# Altium project CtrlBoard_V3.PrjPcb
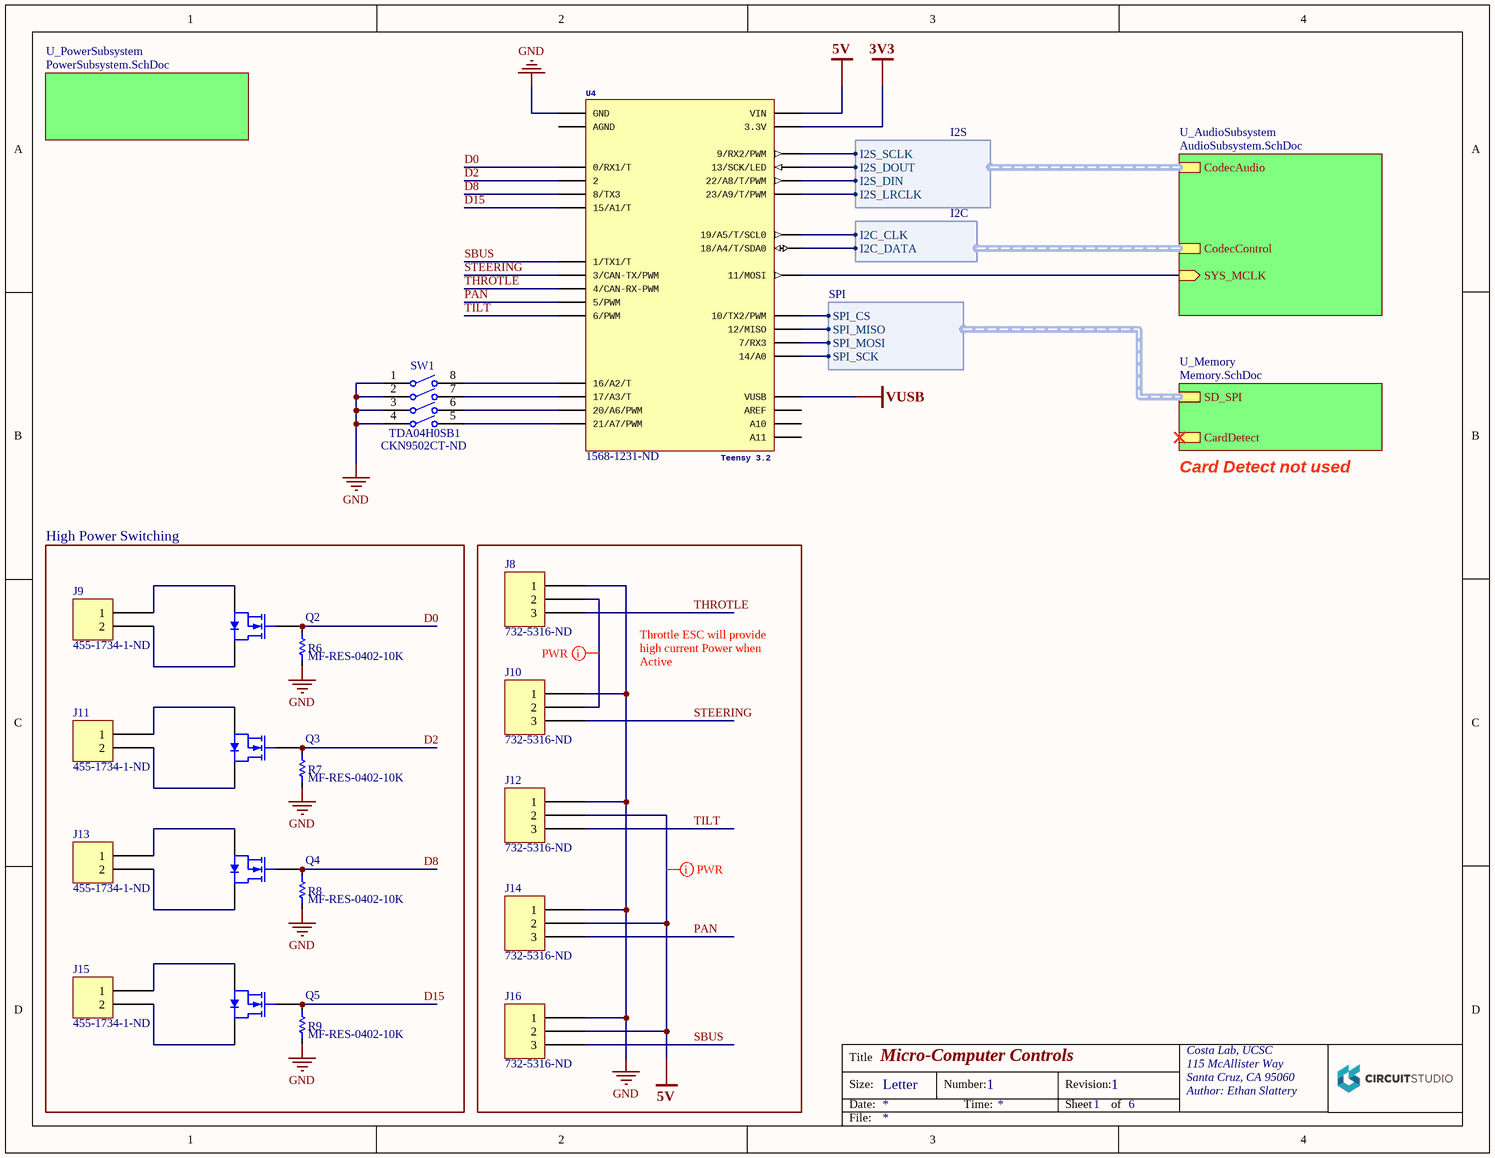
[diagram p0: Teensy32.SchDoc]
Organization: Costa Lab, UCSC; Author: Ethan Slattery; Address3: Author: Ethan Slattery; Address2: Santa Cruz, CA 95060; Address1: 115 McAllister Way
6 sheets, 57 parts. Net scope: hierarchical (ports join the sheet entries above them; power ports are global).
Sheets:
  Teensy32.SchDoc
    U_AudioSubsystem = AudioSubsystem.SchDoc
      U_AudioAmp = AudioAmp.SchDoc
      U_AudioCodec = AudioCodec.SchDoc
    U_Memory = Memory.SchDoc
    U_PowerSubsystem = PowerSubsystem.SchDoc

## Sheet Teensy32.SchDoc: Micro-Computer Controls
size Letter; Organization: Costa Lab, UCSC; Address1: 115 McAllister Way; Address2: Santa Cruz, CA 95060; Address3: Author: Ethan Slattery; DocumentNumber: 1; Revision: 1; SheetNumber: 1; SheetTotal: 6

### Parts
(Parts that share a designator on the sheet are numbered #1, #2 ... from top to bottom, then left to right.)
J8  Supplier Part Number 1: 732-5316-ND  [Pinhead_1x3]  (hidden comment: Header)
J9  455-1734-1-ND  [JST B2B-PH-SM4]
J10  Supplier Part Number 1: 732-5316-ND  [Pinhead_1x3]  (hidden comment: Header)
J11  455-1734-1-ND  [JST B2B-PH-SM4]
J12  Supplier Part Number 1: 732-5316-ND  [Pinhead_1x3]  (hidden comment: Header)
J13  455-1734-1-ND  [JST B2B-PH-SM4]
J14  Supplier Part Number 1: 732-5316-ND  [Pinhead_1x3]  (hidden comment: Header)
J15  455-1734-1-ND  [JST B2B-PH-SM4]
J16  Supplier Part Number 1: 732-5316-ND  [Pinhead_1x3]  (hidden comment: Header)
Q2  MOSFET N-Ch  [TO-220]  (value not drawn)
Q3  MOSFET N-Ch  [TO-220]  (value not drawn)
Q4  MOSFET N-Ch  [TO-220]  (value not drawn)
Q5  MOSFET N-Ch  [TO-220]  (value not drawn)
R6#1  MF-RES-0402-10K  [R0402L]
R7  MF-RES-0402-10K  [R0402L]
R8  MF-RES-0402-10K  [R0402L]
R9  MF-RES-0402-10K  [R0402L]
SW1  TDA04H0SB1  Supplier Part Number 1: CKN9502CT-ND  [CKCP-TDA04H0SB1R_V]
U4  Teensy 3.2  Supplier Part Number 1: 1568-1231-ND  [TEENSY_3.0-3.2&LC_SMD+4]

### Blocks framed on the sheet
High Power Switching: J9 J11 J13 J15 Q2-Q5 R6#1 R7-R9

### Sub-sheets
U_AudioSubsystem = AudioSubsystem.SchDoc: SYS_MCLK (in), CodecControl (harness I2C), CodecAudio (harness I2S)
U_Memory = Memory.SchDoc: SD_SPI (harness SPI), CardDetect
U_PowerSubsystem = PowerSubsystem.SchDoc: no entries

### Harnesses
I2S: I2S_DIN, I2S_DOUT, I2S_LRCLK, I2S_SCLK
I2C: I2C_CLK, I2C_DATA
SPI: SPI_CS, SPI_MISO, SPI_MOSI, SPI_SCK

### Nets
3V3: U4.3.3V
5V: J12.2 J14.2 J16.2 U4.VIN
GND: J8.1 J10.1 J12.1 J14.1 J16.1 R6#1.2 R7.2 R8.2 R9.2 SW1.1 SW1.2 SW1.3 SW1.4 U4.GND
VUSB: U4.VUSB
D0: Q2.1(G) R6#1.1 U4.0(0/RX1/T)  [project net D0_1]
D2: Q3.1(G) R7.1 U4.2  [project net D2_1]
D8: Q4.1(G) R8.1 U4.8(8/TX3)  [project net D8_1]
D15: Q5.1(G) R9.1 U4.15/A1(15/A1/T)  [project net D15_1]
PAN: J14.3 U4.5(5/PWM)  [project net PAN_1]
SBUS: J16.3 U4.1(1/TX1/T)  [project net SBUS_1]
STEERING: J10.3 U4.3(3/CAN-TX/PWM)  [project net STEERING_1]
SYS_MCLK: U4.11(11/MOSI) ; sheet U_AudioSubsystem/SYS_MCLK
THROTLE: J8.3 U4.4(4/CAN-RX-PWM)  [project net THROTLE_1]
TILT: J12.3 U4.6(6/PWM)  [project net TILT_1]
NetJ8_2: J8.2 J10.2
NetJ9_1: J9.1 Q2.3(S)
NetJ9_2: J9.2 Q2.2(D)
NetJ11_1: J11.1 Q3.3(S)
NetJ11_2: J11.2 Q3.2(D)
NetJ13_1: J13.1 Q4.3(S)
NetJ13_2: J13.2 Q4.2(D)
NetJ15_1: J15.1 Q5.3(S)
NetJ15_2: J15.2 Q5.2(D)
NetSW1_5: SW1.5 U4.21/A7(21/A7/PWM)
NetSW1_6: SW1.6 U4.20/A6(20/A6/PWM)
NetSW1_7: SW1.7 U4.17/A3(17/A3/T)
NetSW1_8: SW1.8 U4.16/A2(16/A2/T)
NetU2_14: U4.23/A9(23/A9/T/PWM) ; sheet U_AudioSubsystem/CodecAudio.I2S_LRCLK
NetU2_15: U4.9(9/RX2/PWM) ; sheet U_AudioSubsystem/CodecAudio.I2S_SCLK
NetU2_16: U4.13(13/SCK/LED) ; sheet U_AudioSubsystem/CodecAudio.I2S_DOUT
NetU2_17: U4.22/A8(22/A8/T/PWM) ; sheet U_AudioSubsystem/CodecAudio.I2S_DIN
NetU2_18: U4.18/A4(18/A4/T/SDA0) ; sheet U_AudioSubsystem/CodecControl.I2C_DATA
NetU2_19: U4.19/A5(19/A5/T/SCL0) ; sheet U_AudioSubsystem/CodecControl.I2C_CLK
NetU4_7: U4.7(7/RX3) ; sheet U_Memory/SD_SPI.SPI_MOSI
NetU4_10: U4.10(10/TX2/PWM) ; sheet U_Memory/SD_SPI.SPI_CS
NetU4_12: U4.12(12/MISO) ; sheet U_Memory/SD_SPI.SPI_MISO
NetU4_14/A0: U4.14/A0 ; sheet U_Memory/SD_SPI.SPI_SCK

Not connected (* = marked no-connect by the designer): U4 A10 A11 AGND AREF

### Layout directives
net class PWR: 5V, NetJ8_2

### Notes on the sheet
- Card Detect not used
- Throttle ESC will provide high current Power when Active
- Title
- Size:
- Date:
- Letter
- Number:
- Time:
- Revision:
- Sheet
- of
- File:

### Library data of the parts
J8 J10 J12 J14 J16 = 3 Pin: Supplier 1: Digi-Key
J9 J11 J13 J15 = 2 Pin: Supplier 1: Digi-Key; Supplier Part Number 1: 455-1734-1-ND
R6#1 R7-R9 = RESISTOR: HOUSEPART: YES; POPULATE: 1; TOLERANCE: 5%; VOLTAGE: 50V; WATTAGE: 100mW; VALUE: 10K; SymbolName_1: RESISTOR; LibraryName: MF_Passives; DeviceSetName: RESISTOR; MF_PARTNUM: MF-RES-0402-10K
SW1 = CMP-1727-00001-1: Ultra-Miniature Surface Mount Half-Pitch DIP Switch, 25 mA, 24 V, -40 to 85 degC, 8-Pin SMD, RoHS, Tube; Contact Current Rating: 100 mA; Throw Configuration: SPST; Voltage Rating (DC): 24 V; Max Contact Resistance: 100 mohm; Max Current Rating: 25 mA; REACH SVHC: No SVHC; DatasheetVersion: 02/2016; Case\Package: DIP; Package Quantity: 70; Lead Pitch: 1.27 mm; Contact Plating: Gold; Packaging: Rail/Tube; Contact Finish: Gold; Mount: Surface Mount; Height: 2.3 mm; Contact Material: Copper; Max Operating Temperature: 85 degC; Max Voltage Rating (DC): 24 V; ComponentLink1URL: http://www.ck-components.com/media/1328/tda.pdf; PackageDescription: 8-Pin Surface Mount Device, Body 6.21 x 6.2 mm, Pitch 1.27 mm; Radiation Hardening: No; ComponentLink1Description: Datasheet; Current Rating: 100 mA; RoHSCompliant: true; PackageReference: TDA04H0SB1R; Min Operating Temperature: -40 degC; Pins: 4; Mounting Technology: Surface Mount; Length: 6.21 mm; Supplier 1: Digi-Key
U4 = TEENSY 3.2 + 4: Teensy 3.2 /w 4 inner pins; Processor: MK20DX256VLH7; Clock Speed: 72MHz; Flash: 256 kb; RAM: 64 kb; DMA Channels: 4; USB: Yes; ADCs: 2; DeviceName: Teensy 3.2; URL: https://www.pjrc.com/teensy/teensy31.html; Supplier 1: Digi-Key
Q2-Q5 = MOSFET N-Ch: MF_PARTNUM: *; HOUSEPART: *; POPULATE: *; MPN: *; Mounting Technology: *; Package Description: *; Continous Drain Current (Id): *; Drain-Source Voltage (Vds): *; Gate-Source Votlage (Vgs): *; Power Dissapation (Pd): *; Supplier 1: Digi-Key; Supplier Part Number 1: FQP30N06L-ND

## Sheet AudioSubsystem.SchDoc: Audio Subsystem
size Letter; Organization: Costa Lab, UCSC; Address1: 115 McAllister Way; Address2: Santa Cruz, CA 95060; Address3: Author: Ethan Slattery; DocumentNumber: 4; Revision: 1; SheetNumber: 4; SheetTotal: 6
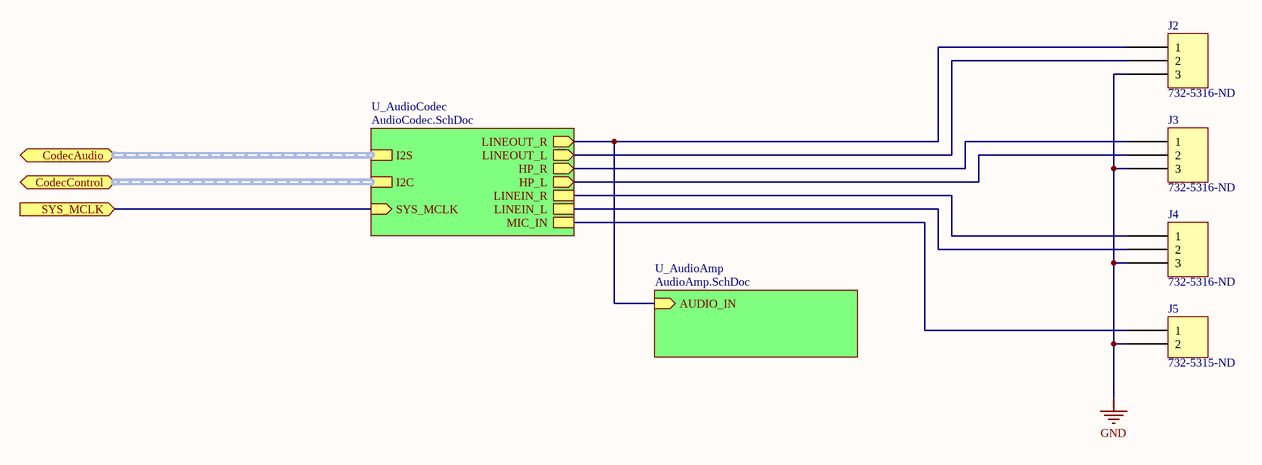
[diagram p1: AudioSubsystem.SchDoc]

### Parts
J2  Supplier Part Number 1: 732-5316-ND  [Pinhead_1x3]  (hidden comment: Header)
J3  Supplier Part Number 1: 732-5316-ND  [Pinhead_1x3]  (hidden comment: Header)
J4  Supplier Part Number 1: 732-5316-ND  [Pinhead_1x3]  (hidden comment: Header)
J5  Supplier Part Number 1: 732-5315-ND  [Pinhead_1x2]  (hidden comment: 2 Pin)

### Sub-sheets
U_AudioAmp = AudioAmp.SchDoc: AUDIO_IN (in)
U_AudioCodec = AudioCodec.SchDoc: LINEIN_L, LINEIN_R, LINEOUT_R (out), LINEOUT_L (out), HP_R (out), HP_L (out), MIC_IN, I2S (harness I2S), SYS_MCLK (in), I2C (harness I2C)

### Ports
CodecAudio (harness I2S), CodecControl (harness I2C), SYS_MCLK (in)

### Nets
GND: J2.3 J3.3 J4.3 J5.2
AUDIO_IN: J2.1 ; sheet U_AudioAmp/AUDIO_IN, sheet U_AudioCodec/LINEOUT_R
HP_L: J3.2 ; sheet U_AudioCodec/HP_L
HP_R: J3.1 ; sheet U_AudioCodec/HP_R
LINEIN_L: J4.2 ; sheet U_AudioCodec/LINEIN_L
LINEIN_R: J4.1 ; sheet U_AudioCodec/LINEIN_R
LINEOUT_L: J2.2 ; sheet U_AudioCodec/LINEOUT_L
MIC_IN: J5.1 ; sheet U_AudioCodec/MIC_IN
SYS_MCLK: port SYS_MCLK, sheet U_AudioCodec/SYS_MCLK

### Buses and harness runs
harness port CodecAudio = sheet U_AudioCodec/I2S
harness port CodecControl = sheet U_AudioCodec/I2C

### Notes on the sheet
- Title
- Size:
- Date:
- Letter
- Number:
- Time:
- Revision:
- Sheet
- of
- File:

### Library data of the parts
J2-J4 = 3 Pin: Supplier 1: Digi-Key
J5 = 2 Pin: Supplier 1: Digi-Key

## Sheet AudioAmp.SchDoc: Audio Amplifier
size Letter; Organization: Costa Lab, UCSC; Address1: 115 McAllister Way; Address2: Santa Cruz, CA 95060; Address3: Author: Ethan Slattery; DocumentNumber: 5; Revision: 1; SheetNumber: 5; SheetTotal: 6
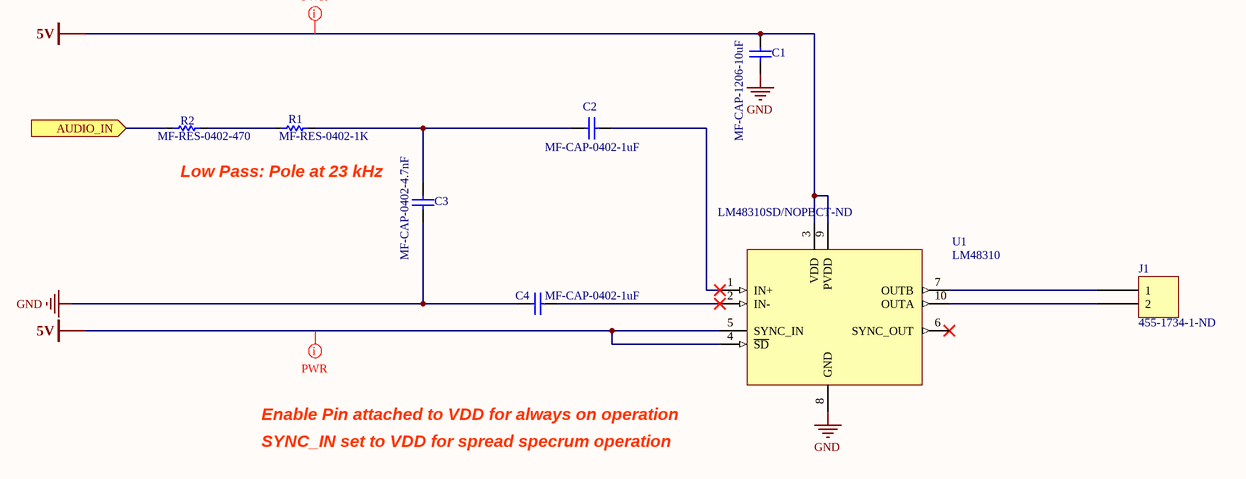
[diagram p2: AudioAmp.SchDoc]

### Parts
C1  MF-CAP-1206-10uF  [C1206L]
C2  MF-CAP-0402-1uF  [C0402N]
C3  MF-CAP-0402-4.7nF  [C1206N]
C4  MF-CAP-0402-1uF  [C0402N]
J1  455-1734-1-ND  [JST B2B-PH-SM4]
R1  MF-RES-0402-1K  [R0402L]
R2  MF-RES-0402-470  [R1206N]
U1  LM48310  Supplier Part Number 1: LM48310SD/NOPBCT-ND  [LM48310_l]

### Ports
AUDIO_IN (in)

### Nets
5V: C1.1 U1.3(VDD) U1.4(~{SD}) U1.5(SYNC_IN) U1.9(PVDD)
GND: C1.2 C3.1 C4.2 U1.8(GND)
AUDIO_IN: R2.1 ; port AUDIO_IN
NetC2_1: C2.1 U1.1(IN+)
NetC2_2: C2.2 C3.2 R1.2
NetC4_1: C4.1 U1.2(IN-)
NetJ1_1: J1.1 U1.7(OUTB)
NetJ1_2: J1.2 U1.10(OUTA)
NetR1_1: R1.1 R2.2

Not connected (* = marked no-connect by the designer): U1 6(SYNC_OUT)*

### Layout directives
net class PWR: 5V

### Notes on the sheet
- Low Pass: Pole at 23 kHz
- Enable Pin attached to VDD for always on operation
- SYNC_IN set to VDD for spread specrum operation
- Title
- Size:
- Date:
- Letter
- Number:
- Time:
- Revision:
- Sheet
- of
- File:

### Library data of the parts
C1 = CAPACITOR_NP: HOUSEPART: YES; POPULATE: 1; TOLERANCE: 10%; VOLTAGE: 16V; VALUE: 10uF; LibraryName: MF_Passives; DeviceSetName: CAPACITOR_NP; MF_PARTNUM: MF-CAP-1206-10uF; Supplier 1: Digi-Key; Supplier Part Number 1: 445-1426-1-ND
C2 C4 = CAPACITOR_NP: HOUSEPART: YES; POPULATE: 1; TOLERANCE: 10%; VOLTAGE: 16V; Capacitance: 1uF; LibraryName: MF_Passives; DeviceSetName: CAPACITOR_NP; MF_PARTNUM: MF-CAP-0402-1uF; Supplier 1: Digi-Key; Supplier Part Number 1: 490-10453-1-ND
C3 = CAPACITOR_NP: HOUSEPART: YES; POPULATE: 1; VALUE: 4.7nF; LibraryName: MF_Passives; DeviceSetName: CAPACITOR_NP; MF_PARTNUM: MF-CAP-0402-4.7nF
J1 = 2 Pin: Supplier 1: Digi-Key; Supplier Part Number 1: 455-1734-1-ND
R1 = RESISTOR: HOUSEPART: YES; POPULATE: 1; VOLTAGE: 50 V; WATTAGE: 100mW; VALUE: 1K; SymbolName_1: RESISTOR; LibraryName: MF_Passives; DeviceSetName: RESISTOR; MF_PARTNUM: MF-RES-0402-1K
R2 = RESISTOR: HOUSEPART: YES; POPULATE: 1; TOLERANCE: 5%; VOLTAGE: 50V; WATTAGE: 100mW; SymbolName_1: RESISTOR; LibraryName: MF_Passives; DeviceSetName: RESISTOR; MF_PARTNUM: MF-RES-0402-470
U1 = LM48310: Supplier 1: Digi-Key

## Sheet AudioCodec.SchDoc: Audio Codec
size Letter; Organization: Costa Lab, UCSC; Address1: 115 McAllister Way; Address2: Santa Cruz, CA 95060; Address3: Author: Ethan Slattery; DocumentNumber: 6; Revision: 1; SheetNumber: 6; SheetTotal: 6
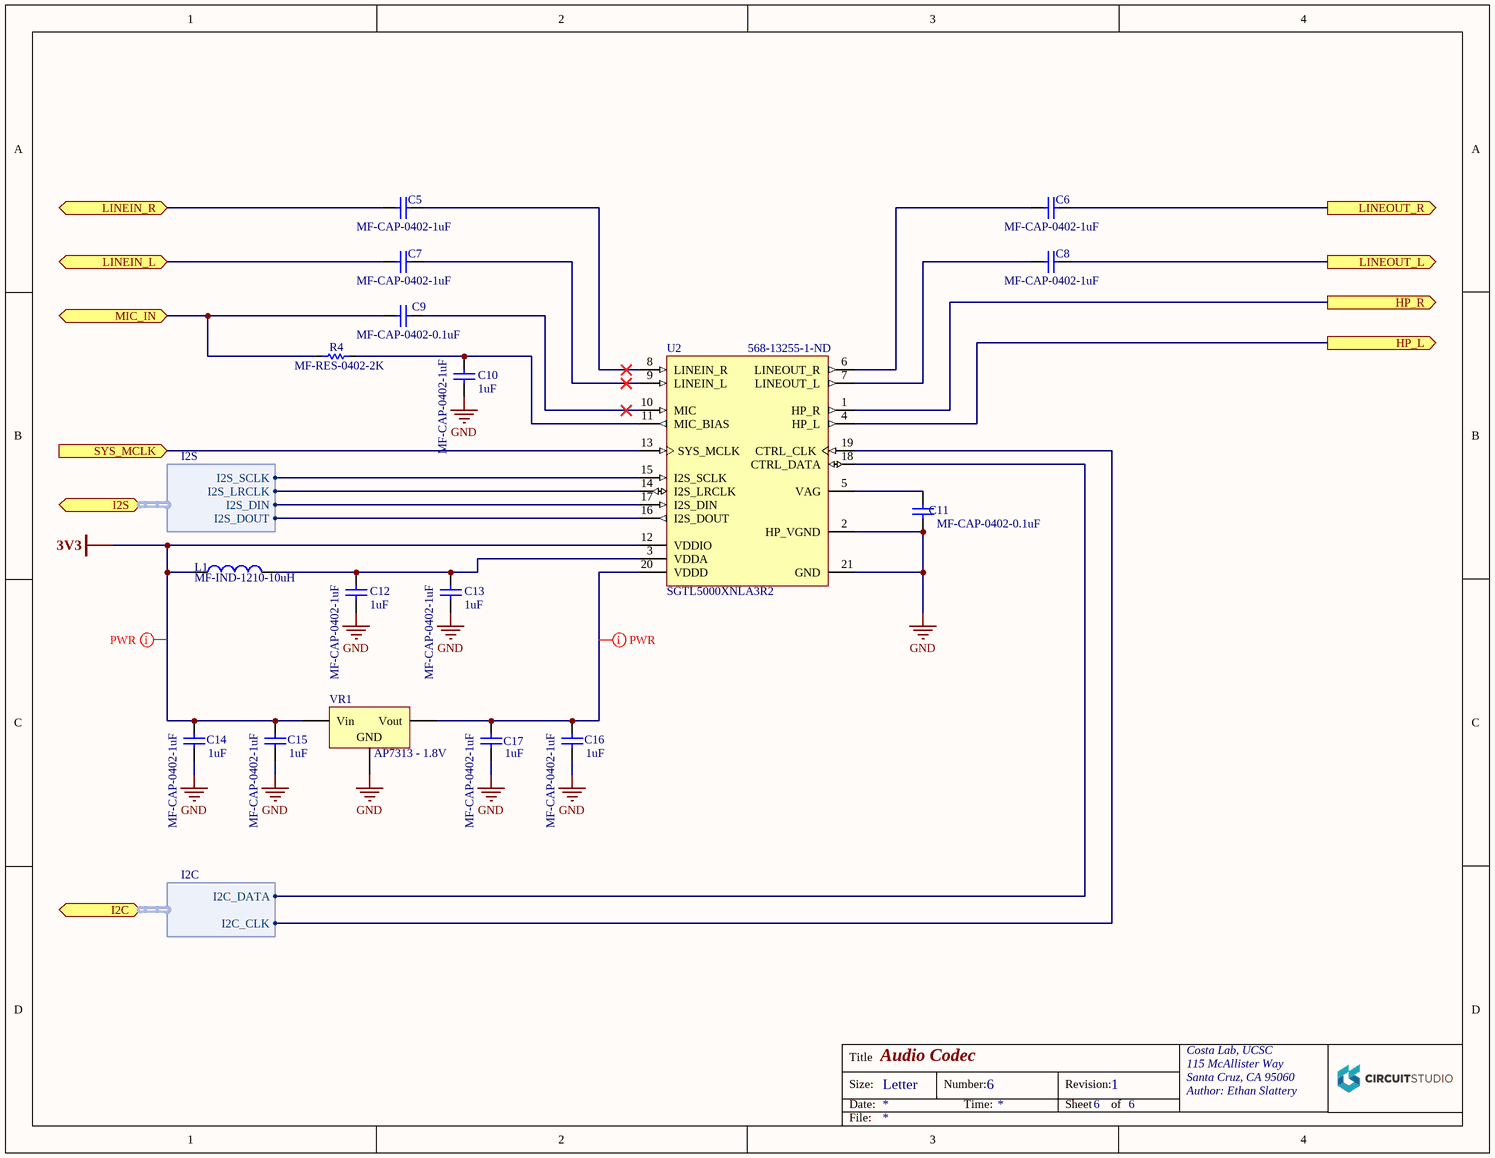
[diagram p3: AudioCodec.SchDoc]

### Parts
(Parts that share a designator on the sheet are numbered #1, #2 ... from top to bottom, then left to right.)
C5  MF-CAP-0402-1uF  [C0402N]
C6  MF-CAP-0402-1uF  [C0402N]
C7  MF-CAP-0402-1uF  [C0402N]
C8  MF-CAP-0402-1uF  [C0402N]
C9  MF-CAP-0402-0.1uF  [C0402N]
C10  MF-CAP-0402-1uF  Capacitance: 1uF  [C0402N]
C11  MF-CAP-0402-0.1uF  [C0402N]
C12  MF-CAP-0402-1uF  Capacitance: 1uF  [C0402N]
C13  MF-CAP-0402-1uF  Capacitance: 1uF  [C0402N]
C14  MF-CAP-0402-1uF  Capacitance: 1uF  [C0402N]
C15  MF-CAP-0402-1uF  Capacitance: 1uF  [C0402N]
C16  MF-CAP-0402-1uF  Capacitance: 1uF  [C0402N]
C17  MF-CAP-0402-1uF  Capacitance: 1uF  [C0402N]
L1  MF-IND-1210-10uH  [L1210_N]
R4#1  MF-RES-0402-2K  [R0402L]
U2  SGTL5000XNLA3R2  Supplier Part Number 1: 568-13255-1-ND  [FRES-2032-01_L]
VR1  AP7313 - 1.8V  [AP7313_L]

### Ports
HP_L (out), HP_R (out), I2C (harness I2C), I2S (harness I2S), LINEIN_L, LINEIN_R, LINEOUT_L (out), LINEOUT_R (out), MIC_IN, SYS_MCLK (in)

### Harnesses
I2S: I2S_SCLK, I2S_LRCLK, I2S_DIN, I2S_DOUT
I2C: I2C_CLK, I2C_DATA

### Nets
3V3: C14.1 C15.1 L1.1 U2.12(VDDIO) VR1.1(Vin)
GND: C10.2 C11.2 C12.2 C13.2 C14.2 C15.2 C16.2 C17.2 U2.2(HP_VGND) U2.21(GND) VR1.3(GND)
AUDIO_IN: C6.1 ; port LINEOUT_R
HP_L: U2.4(HP_L) ; port HP_L
HP_R: U2.1(HP_R) ; port HP_R
LINEIN_L: C7.2 ; port LINEIN_L
LINEIN_R: C5.2 ; port LINEIN_R
LINEOUT_L: C8.1 ; port LINEOUT_L
MIC_IN: C9.2 R4#1.1 ; port MIC_IN
SYS_MCLK: U2.13(SYS_MCLK) ; port SYS_MCLK
NetC5_1: C5.1 U2.8(LINEIN_R)
NetC6_2: C6.2 U2.6(LINEOUT_R)
NetC7_1: C7.1 U2.9(LINEIN_L)
NetC8_2: C8.2 U2.7(LINEOUT_L)
NetC9_1: C9.1 U2.10(MIC)
NetC10_1: C10.1 R4#1.2 U2.11(MIC_BIAS)
NetC11_1: C11.1 U2.5(VAG)
NetC12_1: C12.1 C13.1 L1.2 U2.3(VDDA)
NetC16_1: C16.1 C17.1 U2.20(VDDD) VR1.2(Vout)
NetU2_14: U2.14(I2S_LRCLK) ; port I2S.I2S_LRCLK
NetU2_15: U2.15(I2S_SCLK) ; port I2S.I2S_SCLK
NetU2_16: U2.16(I2S_DOUT) ; port I2S.I2S_DOUT
NetU2_17: U2.17(I2S_DIN) ; port I2S.I2S_DIN
NetU2_18: U2.18(CTRL_DATA) ; port I2C.I2C_DATA
NetU2_19: U2.19(CTRL_CLK) ; port I2C.I2C_CLK

### Layout directives
net class PWR: 3V3, NetC16_1

### Notes on the sheet
- Title
- Size:
- Date:
- Letter
- Number:
- Time:
- Revision:
- Sheet
- of
- File:

### Library data of the parts
C5-C8 = CAPACITOR_NP: as C2 on sheet AudioAmp; LibraryName: MF_Passives; DeviceSetName: CAPACITOR_NP; MF_PARTNUM: MF-CAP-0402-1uF; Supplier 1: Digi-Key; Supplier Part Number 1: 490-10453-1-ND
C9 C11 = CAPACITOR_NP: HOUSEPART: YES; POPULATE: 1; TOLERANCE: 10%; VOLTAGE: 16V; Capacitance: 100nF; LibraryName: MF_Passives; DeviceSetName: CAPACITOR_NP; MF_PARTNUM: MF-CAP-0402-0.1uF; Supplier 1: Digi-Key; Supplier Part Number 1: 490-5415-1-ND
C10 C12-C17 = CAPACITOR_NP: HOUSEPART: YES; POPULATE: 1; LibraryName: MF_Passives; DeviceSetName: CAPACITOR_NP; MF_PARTNUM: MF-CAP-0402-1uF; Supplier 1: Digi-Key; Supplier Part Number 1: 490-10453-1-ND
L1 = INDUCTOR: HOUSEPART: YES; POPULATE: 1; LibraryName: MF_Passives; DeviceSetName: INDUCTOR; MF_PARTNUM: MF-IND-1210-10uH; Supplier 1: Digi-Key; Supplier Part Number 1: 732-4670-1-ND
R4#1 = RESISTOR: HOUSEPART: YES; POPULATE: 1; VOLTAGE: 50 V; WATTAGE: 100mW; VALUE: 2K; SymbolName_1: RESISTOR; LibraryName: MF_Passives; DeviceSetName: RESISTOR; MF_PARTNUM: MF-RES-0402-2K
U2 = CMP-1078-00004-1: Low Power Stereo Codec with Headphone Amp, 1.1 to 2 V, -40 to 85 degC, 20-Pin QFN-EP, RoHS, Tape and Reel; Manufacturer: Freescale Semiconductor; SYS_MCLK Rise/Fall Time: 0.5 to 10 ns; VDDD(V): 1.1 to 2; LINEOUT Output Impedance: 320 Ohm Typ.; VDDIO(V): 1.62 to 3.6; MIC Input Impedance: 2.9 KOhm Typ.; ComponentLink1Description: Manufacturer URL; ComponentLink2Description: Datasheet; Temperature Range: -40 to 85 degC; PartNumber: SGTL5000XNLA3R2; ComponentLink2URL: http://cache.freescale.com/files/analog/doc/data_sheet/SGTL5000.pdf?pspll=1&Parent_nodeId=1227651963351723867067&Parent_pageType=product; RoHS: TRUE; ComponentLink3URL: http://cache.freescale.com/files/shared/doc/package_info/98ARE10742D.pdf?&Parent_nodeId=&Parent_pageType=; ComponentLink1URL: http://www.freescale.com/; Mounting Technology: Surface Mount; ComponentLink3Description: Package Specification; PackageDescription: 20-Pin Thermally Enhanced Quad Flat Non-Lead Package(QFN), Body 3 x 3 mm, Pitch 0.4 mm; Packing: Tape and Reel; DatasheetVersion: Rev. 6.0; PackageVersion: Rev. O; PackageReference: 2032-01; Supplier 1: Digi-Key
VR1 = Volt Reg: Voltage Regulator; Input Voltage: 2V to 6V; Output Voltage: 1V to 3.3V Fixed; Startup Time: 80uS; Current - Output: 150mA; Dropout Voltage: 150mV; Current - Quiescent (Iq): 75µA; PSRR: 65dB (100Hz); Protection Features: Over Current, Over Temperature, Short Circuit; PackageDescription: 3-Pin Transistor Outline Package 2.54 mm Pitch, 15.1 mm Lead Span; Package: SOT23; Operating Temperature: -40°C ~ 85°C; Supplier 1: Digi-Key; Supplier Part Number 1: AP7313-18SAG-7DICT-ND

## Sheet Memory.SchDoc: SPI Memory Module
size Letter; Organization: Costa Lab, UCSC; Address1: 115 McAllister Way; Address2: Santa Cruz, CA 95060; Address3: Author: Ethan Slattery; DocumentNumber: 3; Revision: 1; SheetNumber: 3; SheetTotal: 6
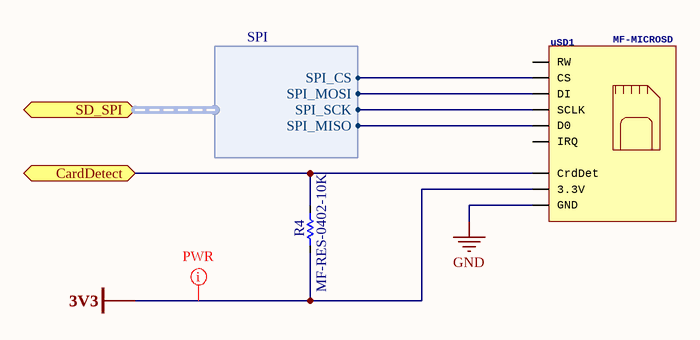
[diagram p4: Memory.SchDoc]

### Parts
(Parts that share a designator on the sheet are numbered #1, #2 ... from top to bottom, then left to right.)
R4#2  MF-RES-0402-10K  [R0402L]
uSD1  MF-MICROSD  [MF-MICROSD]

### Ports
CardDetect, SD_SPI (harness SPI)

### Harnesses
SPI: SPI_CS, SPI_MISO, SPI_MOSI, SPI_SCK

### Nets
3V3: R4#2.1 uSD1.3.3V
GND: uSD1.GND
CardDetect: R4#2.2 uSD1.CrdDet ; port CardDetect
NetU4_7: uSD1.3(DI) ; port SD_SPI.SPI_MOSI
NetU4_10: uSD1.2(CS) ; port SD_SPI.SPI_CS
NetU4_12: uSD1.7(D0) ; port SD_SPI.SPI_MISO
NetU4_14/A0: uSD1.5(SCLK) ; port SD_SPI.SPI_SCK

Not connected (* = marked no-connect by the designer): uSD1 1(RW) 8(IRQ)

### Layout directives
net class PWR: 3V3

### Notes on the sheet
- Title
- Size:
- Date:
- Letter
- Number:
- Time:
- Revision:
- Sheet
- of
- File:

### Library data of the parts
R4#2 = RESISTOR: HOUSEPART: YES; POPULATE: 1; VOLTAGE: 50 V; WATTAGE: 100mW; VALUE: 10K; SymbolName_1: RESISTOR; LibraryName: MF_Passives; DeviceSetName: RESISTOR; MF_PARTNUM: MF-RES-0402-10K
uSD1 = MacroFab uSD card slot: HOUSEPART: YES; SymbolName_1: SD_CARD; DeviceName: _MICRO_RIGHT; DeviceSetName: SD_CARD_SLOT; POPULATE: 1; MPN: MF-MICROSD; URL: https://factory.macrofab.com/part/MF-MICROSD

## Sheet PowerSubsystem.SchDoc: Power Subsystem
size Letter; Organization: Costa Lab, UCSC; Address1: 115 McAllister Way; Address2: Santa Cruz, CA 95060; Address3: Author: Ethan Slattery; DocumentNumber: 2; Revision: 2; SheetNumber: 2; SheetTotal: 6
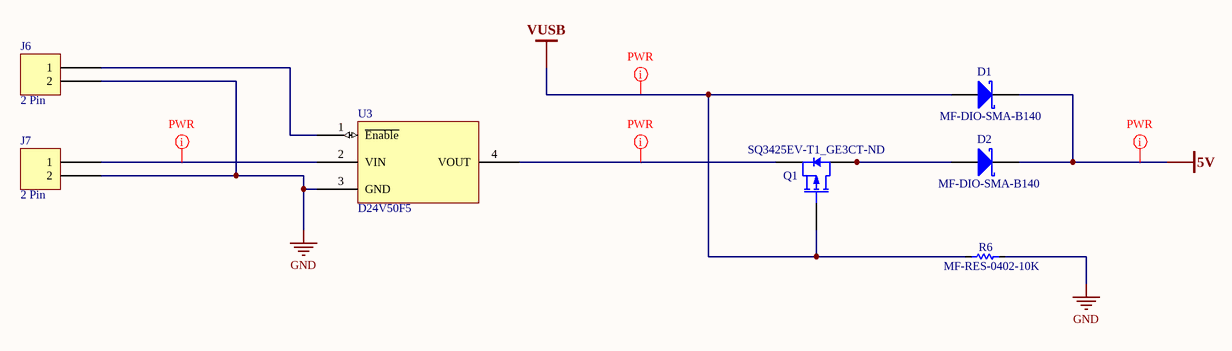
[diagram p5: PowerSubsystem.SchDoc]

### Parts
(Parts that share a designator on the sheet are numbered #1, #2 ... from top to bottom, then left to right.)
D1  MF-DIO-SMA-B140  [Diode SMA]
D2  MF-DIO-SMA-B140  [Diode SMA]
J6  2 Pin  [Pinhead_1x2]
J7  2 Pin  [Pinhead_1x2]
Q1  Supplier Part Number 1: SQ3425EV-T1_GE3CT-ND  [TSOP-6_L]  (hidden comment: MOSFET P-CH SOT26 / SOP-6)
R6#2  MF-RES-0402-10K  [R0402L]
U3  D24V50F5  [D24V50Fx]

### Nets
5V: D1.1(K) D2.1(K)
GND: J6.2 J7.2 R6#2.2 U3.3(GND)
VUSB: D1.2(A) Q1.3(G) R6#2.1
NetD2_2: D2.2(A) Q1.1(D) Q1.2(D) Q1.5(D) Q1.6(D)
NetJ6_1: J6.1 U3.1(~{Enable})
NetJ7_1: J7.1 U3.2(VIN)
NetQ1_4: Q1.4(S) U3.4(VOUT)

### Layout directives
net class PWR: 5V, NetJ7_1, NetQ1_4, VUSB

### Notes on the sheet
- Title
- Size:
- Date:
- Letter
- Number:
- Time:
- Revision:
- Sheet
- of
- File:

### Library data of the parts
D1 D2 = Schottky Diode: HOUSEPART: YES; MPN: B140-13-F; POPULATE: 1; Forward Voltage Drop: .5V; Leakage Current (Ir): 10mA; Surge Current: 30A; Peak Reverse Voltage: 40V; URL: https://s3.amazonaws.com/devpublic1/datasheets/ds13002-60388.pdf; MF_PARTNUM: MF-DIO-SMA-B140; Temperature Range: - 65 C to + 150 C; Peak Current: 30A; Supplier 1: Digi-Key; Supplier Part Number 1: B140-FDICT-ND
Q1 = MOSFET P-CH SOT26 / SOP-6: HOUSEPART: NO; MPN: SQ3425EV; POPULATE: YES; Continous Drain Current (Id): 7.4A; Drain-Source Voltage (Vds): 20V; Gate-Source Votlage (Vgs): 12V; Power Dissapation (Pd): 5W; MF_PARTNUM: SQ3425EV-T1_GE3CT-ND; Mounting Technology: SMD; Package Description: TSOP-6; Supplier 1: Digi-Key
R6#2 = RESISTOR: HOUSEPART: YES; POPULATE: 1; TOLERANCE: 5%; VOLTAGE: 50 V; WATTAGE: 100mW; VALUE: 10K; SymbolName_1: RESISTOR; LibraryName: MF_Passives; DeviceSetName: RESISTOR; MF_PARTNUM: MF-RES-0402-10K
U3 = D24V25Fx: DC Step Down Regulators from Pololu; Current: 5A; Voltage - Min: 38V; Voltage - Max: 6V; Voltage - Output: 5V; Reverse Voltage Protection: YES; Maximum quiescent current: .8mA; POPULATE: 0; Name: D24V50F5; URL: https://www.pololu.com/product/2851

## Nets that join several sheets
3V3: Teensy32 (U4.3.3V), AudioCodec (5 pins), Memory (R4#2.1 uSD1.3.3V)
5V: Teensy32 (J12.2 J14.2 J16.2 U4.VIN), AudioAmp (5 pins), PowerSubsystem (D1.1 D2.1)
GND: Teensy32 (14 pins), AudioSubsystem (J2.3 J3.3 J4.3 J5.2), AudioAmp (C1.2 C3.1 C4.2 U1.8), AudioCodec (11 pins), Memory (uSD1.GND), PowerSubsystem (J6.2 J7.2 R6#2.2 U3.3)
VUSB: Teensy32 (U4.VUSB), PowerSubsystem (D1.2 Q1.3 R6#2.1)
AUDIO_IN: AudioSubsystem (J2.1), AudioAmp (R2.1), AudioCodec (C6.1)
HP_L: AudioSubsystem (J3.2), AudioCodec (U2.4)
HP_R: AudioSubsystem (J3.1), AudioCodec (U2.1)
LINEIN_L: AudioSubsystem (J4.2), AudioCodec (C7.2)
LINEIN_R: AudioSubsystem (J4.1), AudioCodec (C5.2)
LINEOUT_L: AudioSubsystem (J2.2), AudioCodec (C8.1)
MIC_IN: AudioSubsystem (J5.1), AudioCodec (C9.2 R4#1.1)
NetU2_14: Teensy32 (U4.23/A9), AudioCodec (U2.14)
NetU2_15: Teensy32 (U4.9), AudioCodec (U2.15)
NetU2_16: Teensy32 (U4.13), AudioCodec (U2.16)
NetU2_17: Teensy32 (U4.22/A8), AudioCodec (U2.17)
NetU2_18: Teensy32 (U4.18/A4), AudioCodec (U2.18)
NetU2_19: Teensy32 (U4.19/A5), AudioCodec (U2.19)
NetU4_7: Teensy32 (U4.7), Memory (uSD1.3)
NetU4_10: Teensy32 (U4.10), Memory (uSD1.2)
NetU4_12: Teensy32 (U4.12), Memory (uSD1.7)
NetU4_14/A0: Teensy32 (U4.14/A0), Memory (uSD1.5)
SYS_MCLK: Teensy32 (U4.11), AudioCodec (U2.13)